# Altium schematic sheet RPI.SchDoc
size A4; SheetNumber: 1; SheetTotal: 1; SPICEModelCacheZXBWYKKV: <root> / <DocumentId>ZXBWYKKV</DocumentId> / <CacheFrame Number="0"> / <Model Name="irf5305" Kind="CKT"> / <Text>.SUBCKT irf5305 1 2 3 / ************************************** / *      Model Generated by MODPEX     * / *Copyright(c) Symmetry Design Systems* / *         All Rights Reserved        * / *    UNPUBLISHED LICENSED SOFTWARE   * / *   Contains Proprietary Information * / *      Which is The Property of      * / *     SYMMETRY OR ITS LICENSORS      * / *Commercial Use or Resale Restricted * / *   by Symmetry License Agreement    * / ************************************** / * Model generated on Apr 23, 96 / * Model format: SPICE3 / * Symmetry POWER MOS Model (Version 1.0) / * External Node Designations / * Node 1 -&gt; Drain / * Node 2 -&gt; Gate / * Node 3 -&gt; Source / M1 9 7 8 8 MM L=100u W=100u / * Default values used in MM: / * The voltage-dependent capacitances are / * not included. Other default values are: / *   RS=0 RD=0 LD=0 CBD=0 CBS=0 CGBO=0 / .MODEL MM PMOS LEVEL=1 IS=1e-32 / +VTO=-3.45761 LAMBDA=0 KP=10.066 / +CGSO=1.03141e-05 CGDO=1e-11 / RS 8 3 0.0262305 / D1 1 3 MD / .MODEL MD D IS=8.90854e-09 RS=0.00921723 N=1.5 BV=55 / +IBV=0.00025 EG=1.2 XTI=3.13635 TT=1e-07 / +CJO=1.30546e-09 VJ=0.663932 M=0.419045 FC=0.5 / RDS 3 1 2.2e+06 / RD 9 1 0.0001 / RG 2 7 11.0979 / D2 5 4 MD1 / * Default values used in MD1: / *   RS=0 EG=1.11 XTI=3.0 TT=0 / *   BV=infinite IBV=1mA / .MODEL MD1 D IS=1e-32 N=50 / +CJO=1.63729e-09 VJ=0.791199 M=0.552278 FC=1e-08 / D3 5 0 MD2 / * Default values used in MD2: / *   EG=1.11 XTI=3.0 TT=0 CJO=0 / *   BV=infinite IBV=1mA / .MODEL MD2 D IS=1e-10 N=0.400245 RS=3e-06 / RL 5 10 1 / FI2 7 9 VFI2 -1 / VFI2 4 0 0 / EV16 10 0 9 7 1 / CAP 11 10 1.89722e-09 / FI1 7 9 VFI1 -1 / VFI1 11 6 0 / RCAP 6 10 1 / D4 6 0 MD3 / * Default values used in MD3: / *   EG=1.11 XTI=3.0 TT=0 CJO=0 / *   RS=0 BV=infinite IBV=1mA / .MODEL MD3 D IS=1e-10 N=0.400245 / .ENDS</Text> / </Model> / </CacheFrame> / </root>
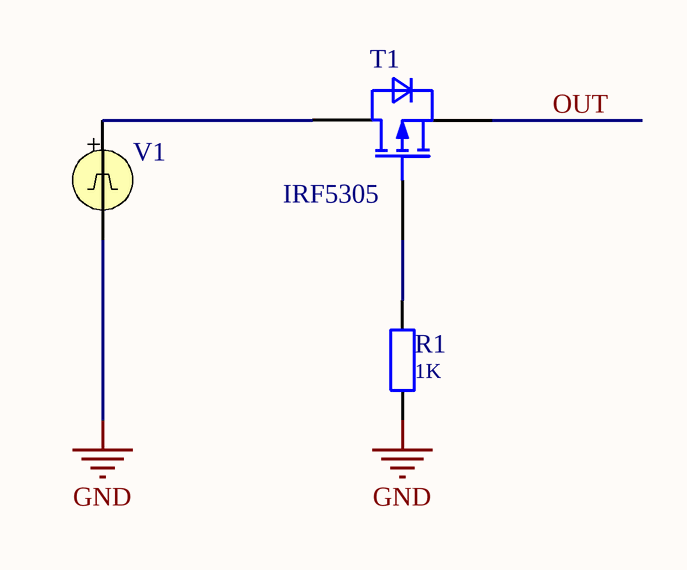
[diagram p0: RPI.SchDoc]

## Parts
R1  1K  [R_0207/RM4]
T1  IRF5305  [PG-TO220-3-904]
V1  PULSE(0 5 0 1u 1u 0.5ms 1ms)  (value not drawn)

## Nets
GND: R1.1 V1.2
OUT: T1.3(DRAIN)
NetR1_2: R1.2 T1.1(GATE)
NetT1_2: T1.2(SOURCE) V1.1

## Notes on the sheet
- Project:
- Title:
- Leitner AG
- Zona Artigianale Est 7
- 39040 Racines BZ
- Italy
- Confidential
- Author:
- Document name:
- Date:
- Version:
- Size:
- A4

## Library data of the parts
R1 = R: Resistor; Usage: only permitted for non-commercial purposes at HTL I Innsbruck; Published: 21-Feb-2011; LatestRevisionDate: 07-Sep-2019; Value: 1K
T1 = IRF5305: OptiMOS - P2 Power-Transistor, P-channel-Enhancement mode, VDS -30V
V1 = VPULSE: Pulse Voltage Source; AC Magnitude: 1; AC Phase: 0; Pulsed Value: 5; DC Magnitude: 0; Fall Time: 1u; Initial Value: 0; Period: 1ms; Pulse Width: 0.5ms; Rise Time: 1u